# EAGLE schematic Schematic (EAGLE 8.6.0)
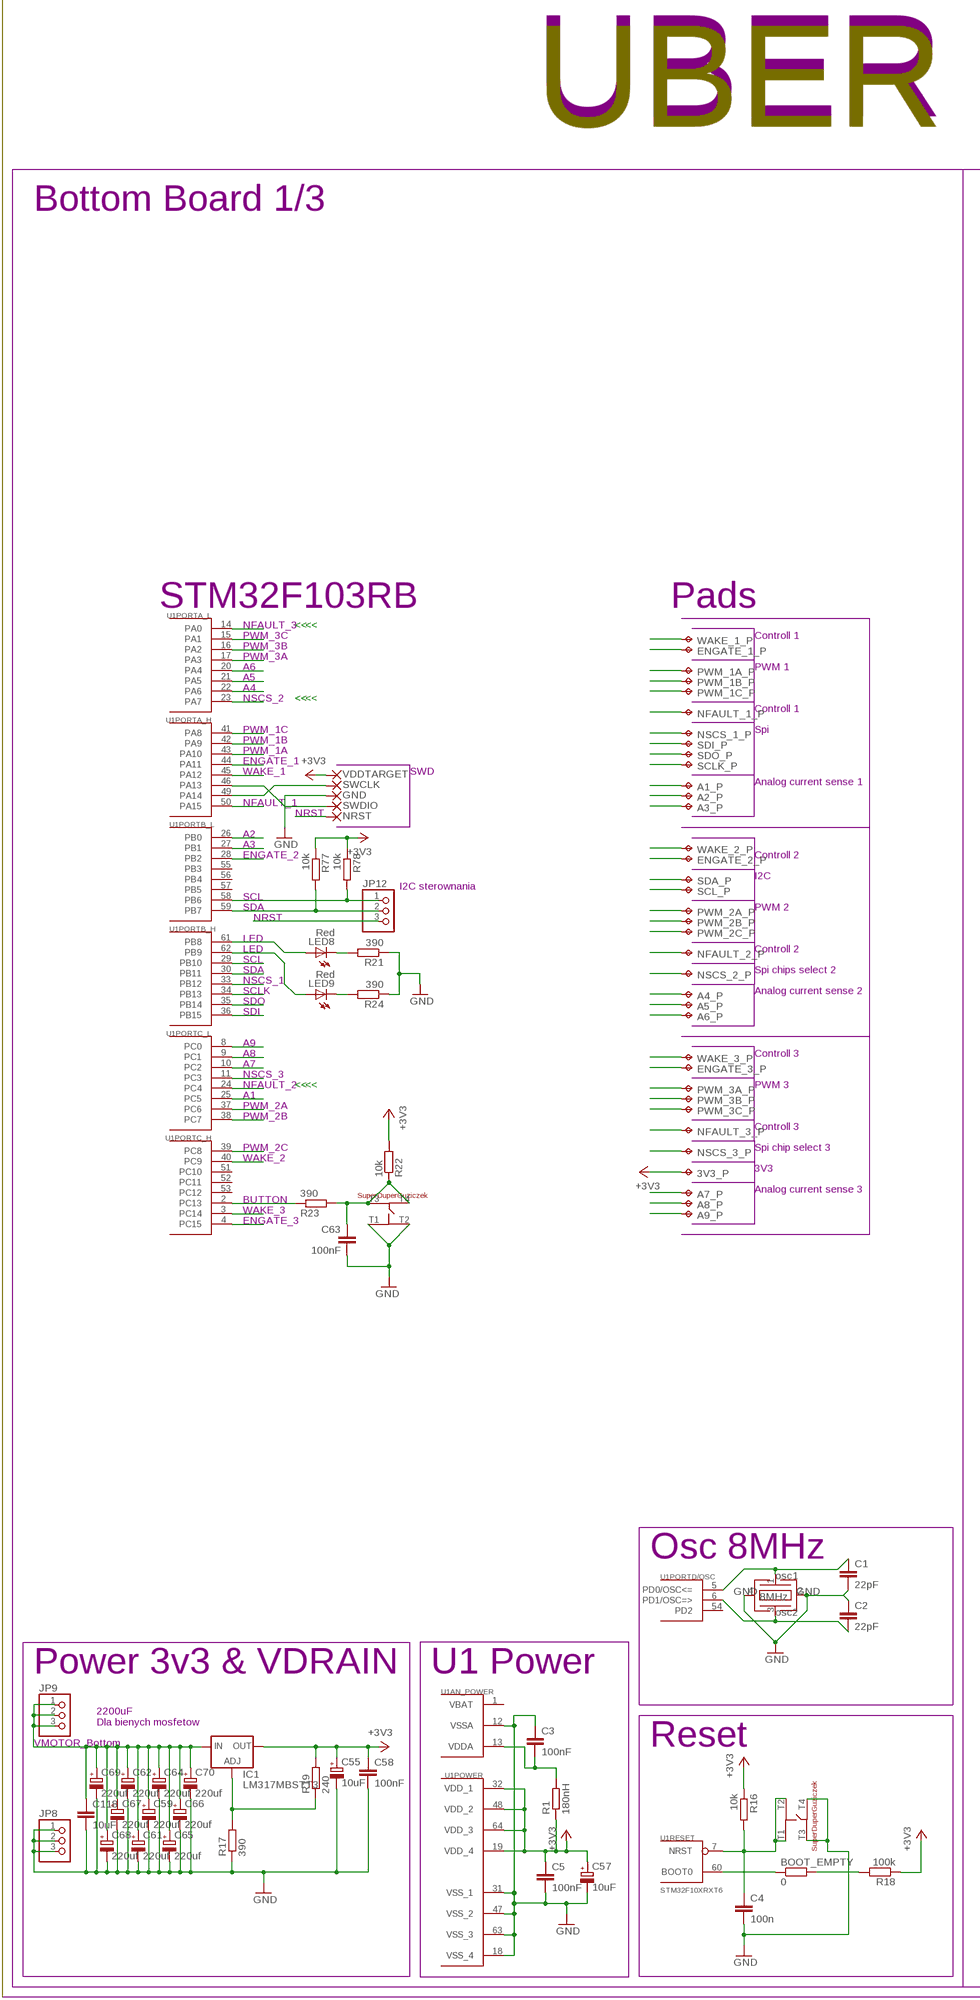
[diagram p0: schematic, sheet 1, part 1 of 3]
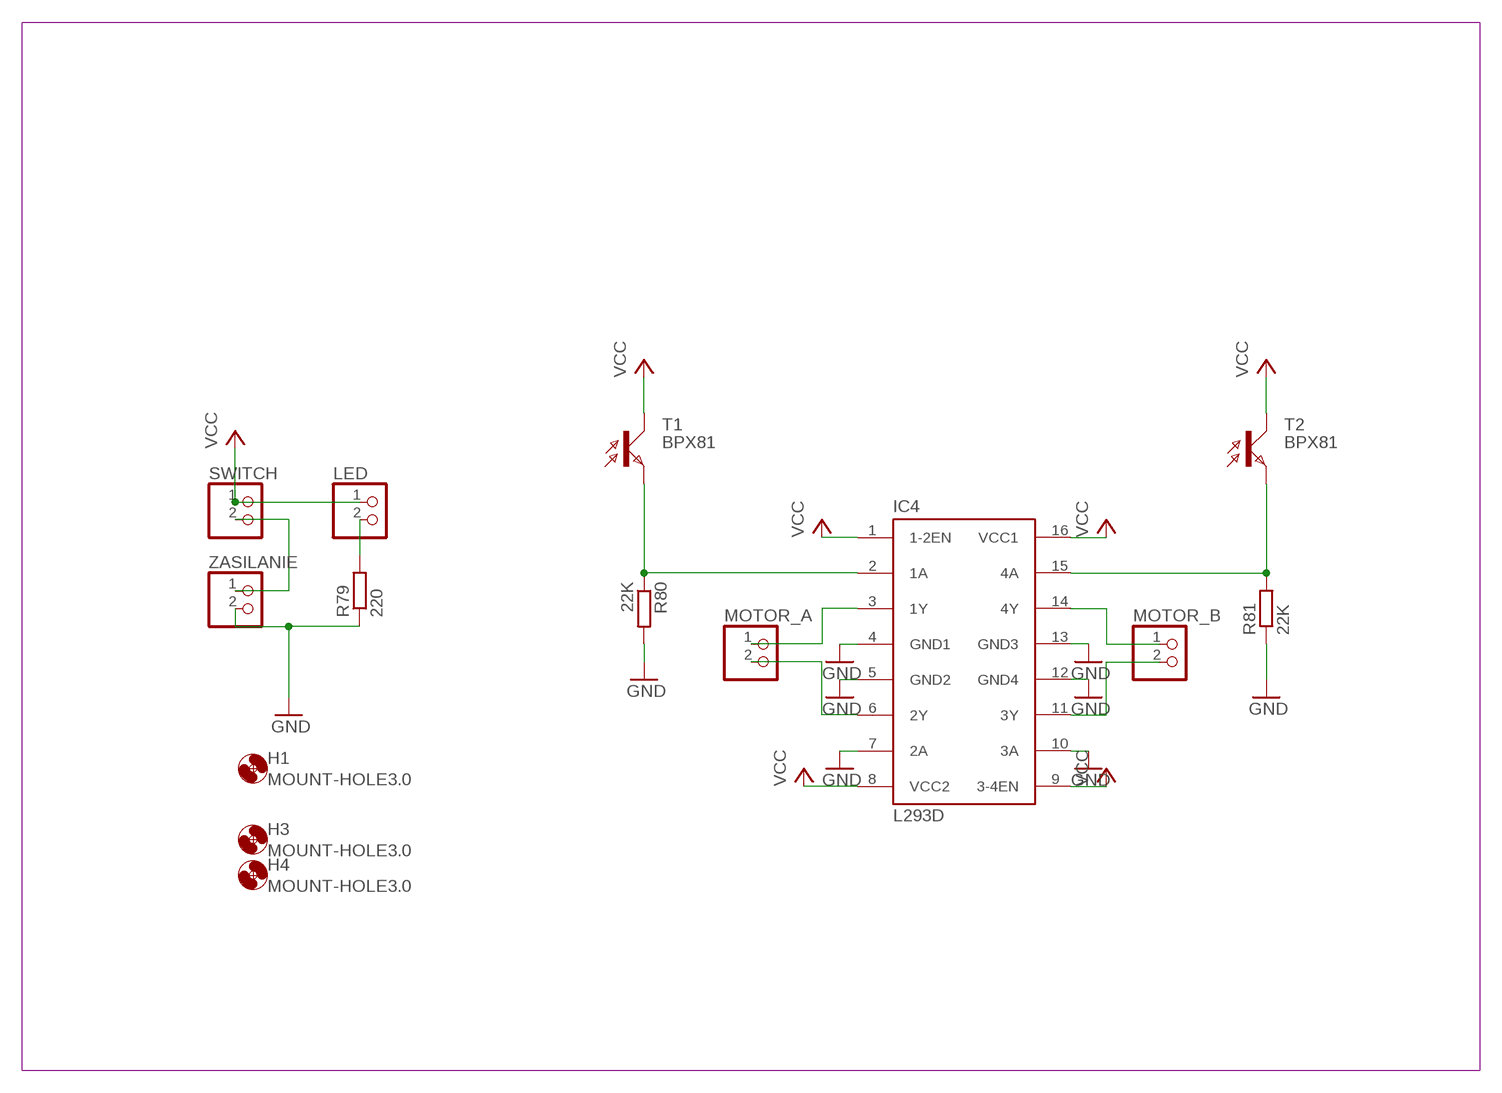
[diagram p1: schematic, sheet 1, part 2 of 3]
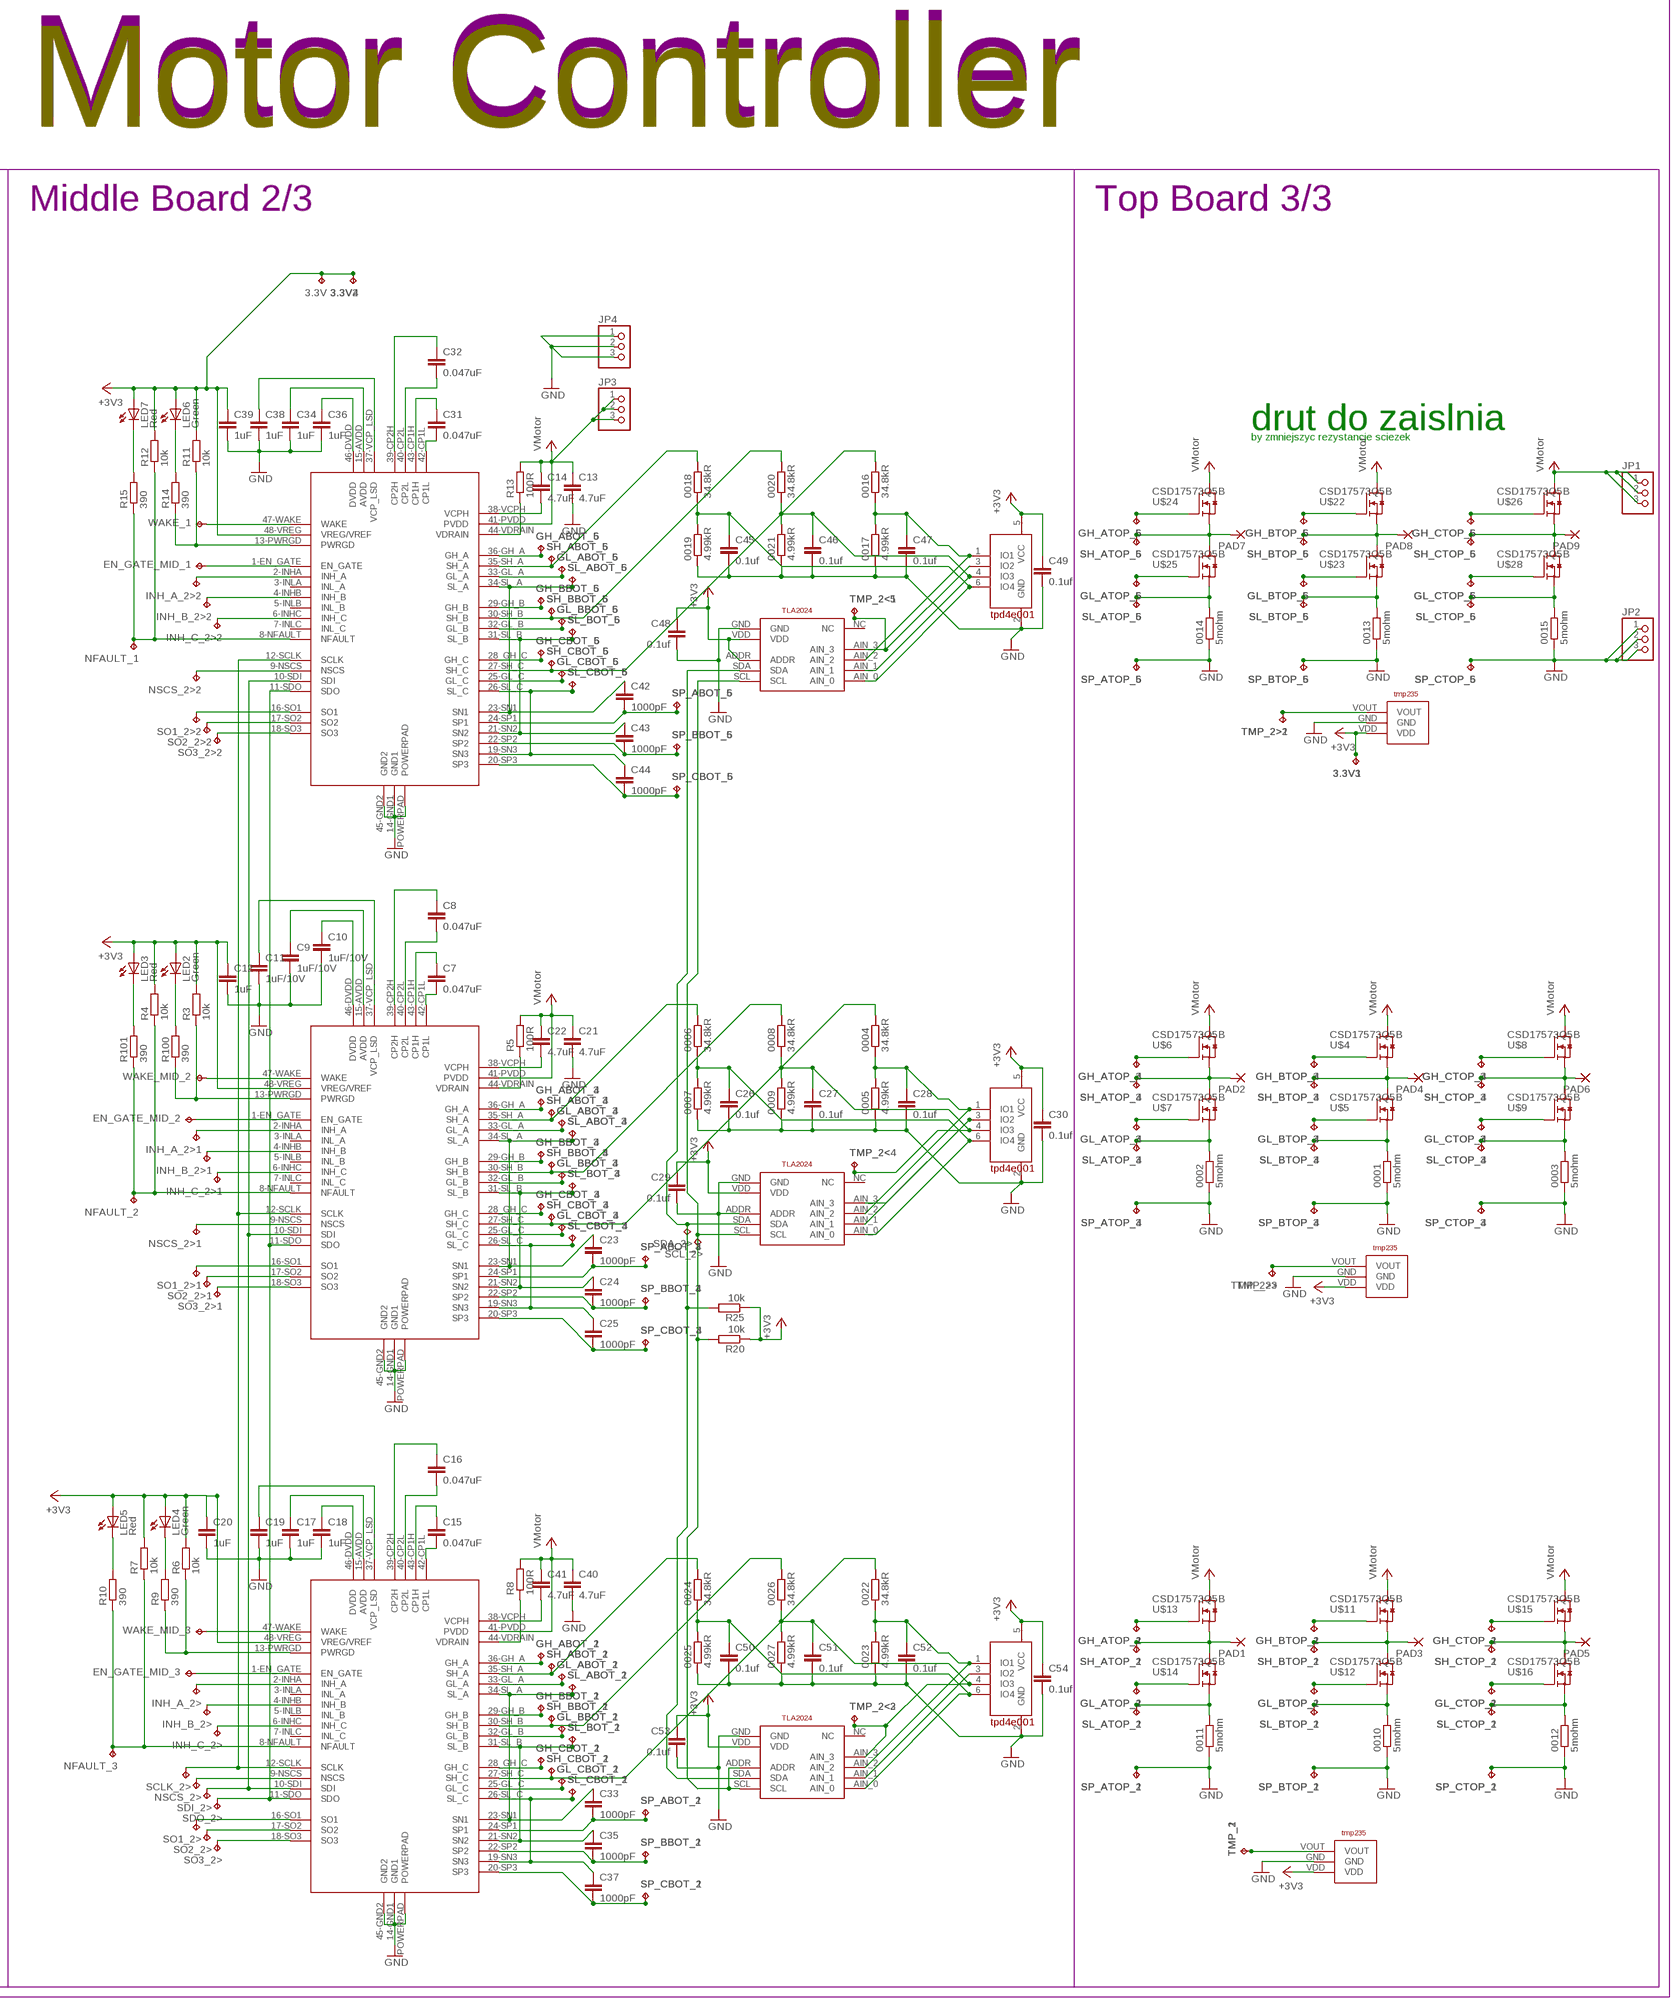
[diagram p2: schematic, sheet 1, part 3 of 3]

## Parts
0001  5mohm  R-EU_R2512  [R2512]
0002  5mohm  R-EU_R2512  [R2512]
0003  5mohm  R-EU_R2512  [R2512]
3.3V  TPTP09SQ  [TP09SQ]
3.3V1  TPTP09SQ  [TP09SQ]
3.3V2  TPTP09SQ  [TP09SQ]
3.3V3  TPTP09SQ  [TP09SQ]
3.3V4  TPTP09SQ  [TP09SQ]
3V3_P  TPTP09SQ  [TP09SQ]
0004  34.8kR  R-EU_R0603  [R0603]
0005  4.99kR  R-EU_R0603  [R0603]
0006  34.8kR  R-EU_R0603  [R0603]
0007  4.99kR  R-EU_R0603  [R0603]
0008  34.8kR  R-EU_R0603  [R0603]
0009  4.99kR  R-EU_R0603  [R0603]
0010  5mohm  R-EU_R2512  [R2512]
0011  5mohm  R-EU_R2512  [R2512]
0012  5mohm  R-EU_R2512  [R2512]
0013  5mohm  R-EU_R2512  [R2512]
0014  5mohm  R-EU_R2512  [R2512]
0015  5mohm  R-EU_R2512  [R2512]
0016  34.8kR  R-EU_R0603  [R0603]
0017  4.99kR  R-EU_R0603  [R0603]
0018  34.8kR  R-EU_R0603  [R0603]
0019  4.99kR  R-EU_R0603  [R0603]
0020  34.8kR  R-EU_R0603  [R0603]
0021  4.99kR  R-EU_R0603  [R0603]
0022  34.8kR  R-EU_R0603  [R0603]
0023  4.99kR  R-EU_R0603  [R0603]
0024  34.8kR  R-EU_R0603  [R0603]
0025  4.99kR  R-EU_R0603  [R0603]
0026  34.8kR  R-EU_R0603  [R0603]
0027  4.99kR  R-EU_R0603  [R0603]
A1_P  TPTP09SQ  [TP09SQ]
A2_P  TPTP09SQ  [TP09SQ]
A3_P  TPTP09SQ  [TP09SQ]
A4_P  TPTP09SQ  [TP09SQ]
A5_P  TPTP09SQ  [TP09SQ]
A6_P  TPTP09SQ  [TP09SQ]
A7_P  TPTP09SQ  [TP09SQ]
A8_P  TPTP09SQ  [TP09SQ]
A9_P  TPTP09SQ  [TP09SQ]
BOOT_EMPTY  0  R-EU_R0603  [R0603]
C1  22pF  C-EUC0603  [C0603]
C2  22pF  C-EUC0603  [C0603]
C3  100nF  C-EUC0603  [C0603]
C4  100n  C-EUC0603  [C0603]
C5  100nF  C-EUC0603  [C0603]
C7  0.047uF  C-EUC0603  [C0603]
C8  0.047uF  C-EUC0603  [C0603]
C9  1uF/10V  C-EUC0603  [C0603]
C10  1uF/10V  C-EUC0603  [C0603]
C11  1uF/10V  C-EUC0603  [C0603]
C12  1uF  C-EUC0603  [C0603]
C13  4.7uF  C-EUC0805  [C0805]
C14  4.7uF  C-EUC0805  [C0805]
C15  0.047uF  C-EUC0603  [C0603]
C16  0.047uF  C-EUC0603  [C0603]
C17  1uF  C-EUC0603  [C0603]
C18  1uF  C-EUC0603  [C0603]
C19  1uF  C-EUC0603  [C0603]
C20  1uF  C-EUC0603  [C0603]
C21  4.7uF  C-EUC0805  [C0805]
C22  4.7uF  C-EUC0805  [C0805]
C23  1000pF  C-EUC0603  [C0603]
C24  1000pF  C-EUC0603  [C0603]
C25  1000pF  C-EUC0603  [C0603]
C26  0.1uf  C-EUC0603  [C0603]
C27  0.1uf  C-EUC0603  [C0603]
C28  0.1uf  C-EUC0603  [C0603]
C29  0.1uf  C-EUC0603  [C0603]
C30  0.1uf  C-EUC0603  [C0603]
C31  0.047uF  C-EUC0603  [C0603]
C32  0.047uF  C-EUC0603  [C0603]
C33  1000pF  C-EUC0603  [C0603]
C34  1uF  C-EUC0603  [C0603]
C35  1000pF  C-EUC0603  [C0603]
C36  1uF  C-EUC0603  [C0603]
C37  1000pF  C-EUC0603  [C0603]
C38  1uF  C-EUC0603  [C0603]
C39  1uF  C-EUC0603  [C0603]
C40  4.7uF  C-EUC0805  [C0805]
C41  4.7uF  C-EUC0805  [C0805]
C42  1000pF  C-EUC0603  [C0603]
C43  1000pF  C-EUC0603  [C0603]
C44  1000pF  C-EUC0603  [C0603]
C45  0.1uf  C-EUC0603  [C0603]
C46  0.1uf  C-EUC0603  [C0603]
C47  0.1uf  C-EUC0603  [C0603]
C48  0.1uf  C-EUC0603  [C0603]
C49  0.1uf  C-EUC0603  [C0603]
C50  0.1uf  C-EUC0603  [C0603]
C51  0.1uf  C-EUC0603  [C0603]
C52  0.1uf  C-EUC0603  [C0603]
C53  0.1uf  C-EUC0603  [C0603]
C54  0.1uf  C-EUC0603  [C0603]
C55  10uF  CPOL-EUSMCA  [SMC_A]
C57  10uF  CPOL-EUSMCA  [SMC_A]
C58  100nF  C-EUC0603  [C0603]
C59  220uf  CPOL-EU150CLZ-0810  [150CLZ-0810]
C61  220uf  CPOL-EU150CLZ-0810  [150CLZ-0810]
C62  220uf  CPOL-EU150CLZ-0810  [150CLZ-0810]
C63  100nF  C-EUC0603  [C0603]
C64  220uf  CPOL-EU150CLZ-0810  [150CLZ-0810]
C65  220uf  CPOL-EU150CLZ-0810  [150CLZ-0810]
C66  220uf  CPOL-EU150CLZ-0810  [150CLZ-0810]
C67  220uf  CPOL-EU150CLZ-0810  [150CLZ-0810]
C68  220uf  CPOL-EU150CLZ-0810  [150CLZ-0810]
C69  220uf  CPOL-EU150CLZ-0810  [150CLZ-0810]
C70  220uf  CPOL-EU150CLZ-0810  [150CLZ-0810]
C118  10uF  C-EUC1206  [C1206]
EN_GATE_MID_1  TPTP09SQ  [TP09SQ]
EN_GATE_MID_2  TPTP09SQ  [TP09SQ]
EN_GATE_MID_3  TPTP09SQ  [TP09SQ]
ENGATE_1_P  TPTP09SQ  [TP09SQ]
ENGATE_2_P  TPTP09SQ  [TP09SQ]
ENGATE_3_P  TPTP09SQ  [TP09SQ]
GH_ABOT_1  TPTP09SQ  [TP09SQ]
GH_ABOT_2  TPTP09SQ  [TP09SQ]
GH_ABOT_3  TPTP09SQ  [TP09SQ]
GH_ABOT_4  TPTP09SQ  [TP09SQ]
GH_ABOT_5  TPTP09SQ  [TP09SQ]
GH_ABOT_6  TPTP09SQ  [TP09SQ]
GH_ATOP_1  TPTP09SQ  [TP09SQ]
GH_ATOP_2  TPTP09SQ  [TP09SQ]
GH_ATOP_3  TPTP09SQ  [TP09SQ]
GH_ATOP_4  TPTP09SQ  [TP09SQ]
GH_ATOP_5  TPTP09SQ  [TP09SQ]
GH_ATOP_6  TPTP09SQ  [TP09SQ]
GH_BBOT_1  TPTP07SQ  [TP07SQ]
GH_BBOT_2  TPTP07SQ  [TP07SQ]
GH_BBOT_3  TPTP07SQ  [TP07SQ]
GH_BBOT_4  TPTP07SQ  [TP07SQ]
GH_BBOT_5  TPTP07SQ  [TP07SQ]
GH_BBOT_6  TPTP07SQ  [TP07SQ]
GH_BTOP_1  TPTP07SQ  [TP07SQ]
GH_BTOP_2  TPTP07SQ  [TP07SQ]
GH_BTOP_3  TPTP07SQ  [TP07SQ]
GH_BTOP_4  TPTP07SQ  [TP07SQ]
GH_BTOP_5  TPTP07SQ  [TP07SQ]
GH_BTOP_6  TPTP07SQ  [TP07SQ]
GH_CBOT_1  TPTP09SQ  [TP09SQ]
GH_CBOT_2  TPTP09SQ  [TP09SQ]
GH_CBOT_3  TPTP09SQ  [TP09SQ]
GH_CBOT_4  TPTP09SQ  [TP09SQ]
GH_CBOT_5  TPTP09SQ  [TP09SQ]
GH_CBOT_6  TPTP09SQ  [TP09SQ]
GH_CTOP_1  TPTP09SQ  [TP09SQ]
GH_CTOP_2  TPTP09SQ  [TP09SQ]
GH_CTOP_3  TPTP09SQ  [TP09SQ]
GH_CTOP_4  TPTP09SQ  [TP09SQ]
GH_CTOP_5  TPTP09SQ  [TP09SQ]
GH_CTOP_6  TPTP09SQ  [TP09SQ]
GL_ABOT_1  TPTP07SQ  [TP07SQ]
GL_ABOT_2  TPTP07SQ  [TP07SQ]
GL_ABOT_3  TPTP07SQ  [TP07SQ]
GL_ABOT_4  TPTP07SQ  [TP07SQ]
GL_ABOT_5  TPTP07SQ  [TP07SQ]
GL_ABOT_6  TPTP07SQ  [TP07SQ]
GL_ATOP_1  TPTP07SQ  [TP07SQ]
GL_ATOP_2  TPTP07SQ  [TP07SQ]
GL_ATOP_3  TPTP07SQ  [TP07SQ]
GL_ATOP_4  TPTP07SQ  [TP07SQ]
GL_ATOP_5  TPTP07SQ  [TP07SQ]
GL_ATOP_6  TPTP07SQ  [TP07SQ]
GL_BBOT_1  TPTP09SQ  [TP09SQ]
GL_BBOT_2  TPTP09SQ  [TP09SQ]
GL_BBOT_3  TPTP09SQ  [TP09SQ]
GL_BBOT_4  TPTP09SQ  [TP09SQ]
GL_BBOT_5  TPTP09SQ  [TP09SQ]
GL_BBOT_6  TPTP09SQ  [TP09SQ]
GL_BTOP_1  TPTP09SQ  [TP09SQ]
GL_BTOP_2  TPTP09SQ  [TP09SQ]
GL_BTOP_3  TPTP09SQ  [TP09SQ]
GL_BTOP_4  TPTP09SQ  [TP09SQ]
GL_BTOP_5  TPTP09SQ  [TP09SQ]
GL_BTOP_6  TPTP09SQ  [TP09SQ]
GL_CBOT_1  TPTP07SQ  [TP07SQ]
GL_CBOT_2  TPTP07SQ  [TP07SQ]
GL_CBOT_3  TPTP07SQ  [TP07SQ]
GL_CBOT_4  TPTP07SQ  [TP07SQ]
GL_CBOT_5  TPTP07SQ  [TP07SQ]
GL_CBOT_6  TPTP07SQ  [TP07SQ]
GL_CTOP_1  TPTP07SQ  [TP07SQ]
GL_CTOP_2  TPTP07SQ  [TP07SQ]
GL_CTOP_3  TPTP07SQ  [TP07SQ]
GL_CTOP_4  TPTP07SQ  [TP07SQ]
GL_CTOP_5  TPTP07SQ  [TP07SQ]
GL_CTOP_6  TPTP07SQ  [TP07SQ]
GND  WIREPADSMD1,27-254  [SMD1,27-2,54]
H1  MOUNT-HOLE3.0  [3,0]
H3  MOUNT-HOLE3.0  [3,0]
H4  MOUNT-HOLE3.0  [3,0]
IC1  LM317MBSTT3  [SOT223]
IC4  L293D  [DIL16]
INH_A_2>  TPTP09SQ  [TP09SQ]
INH_A_2>1  TPTP09SQ  [TP09SQ]
INH_A_2>2  TPTP09SQ  [TP09SQ]
INH_B_2>  TPTP09SQ  [TP09SQ]
INH_B_2>1  TPTP09SQ  [TP09SQ]
INH_B_2>2  TPTP09SQ  [TP09SQ]
INH_C_2>  TPTP09SQ  [TP09SQ]
INH_C_2>1  TPTP09SQ  [TP09SQ]
INH_C_2>2  TPTP09SQ  [TP09SQ]
JP1  PINHD-1X3  [1X03]
JP2  PINHD-1X3  [1X03]
JP3  PINHD-1X3  [1X03]
JP4  PINHD-1X3  [1X03]
JP8  PINHD-1X3  [1X03]
JP9  PINHD-1X3  [1X03]
JP12  PINHD-1X3  [1X03]
LED  PINHD-1X2  [1X02]
LED2  Green  LEDSML0603  [SML0603]
LED3  Red  LEDSML0603  [SML0603]
LED4  Green  LEDSML0603  [SML0603]
LED5  Red  LEDSML0603  [SML0603]
LED6  Green  LEDSML0603  [SML0603]
LED7  Red  LEDSML0603  [SML0603]
LED8  Red  LEDSML0603  [SML0603]
LED9  Red  LEDSML0603  [SML0603]
MOTOR_A  PINHD-1X2  [1X02]
MOTOR_B  PINHD-1X2  [1X02]
NFAULT_1  TPTP09SQ  [TP09SQ]
NFAULT_1_P  TPTP09SQ  [TP09SQ]
NFAULT_2  TPTP09SQ  [TP09SQ]
NFAULT_2_P  TPTP09SQ  [TP09SQ]
NFAULT_3  TPTP09SQ  [TP09SQ]
NFAULT_3_P  TPTP09SQ  [TP09SQ]
NRST  WIREPADSMD1,27-254  [SMD1,27-2,54]
NSCS_1_P  TPTP09SQ  [TP09SQ]
NSCS_2>  TPTP09SQ  [TP09SQ]
NSCS_2>1  TPTP09SQ  [TP09SQ]
NSCS_2>2  TPTP09SQ  [TP09SQ]
NSCS_2_P  TPTP09SQ  [TP09SQ]
NSCS_3_P  TPTP09SQ  [TP09SQ]
PAD1  SMD5  [SMD2,54-5,08]
PAD2  SMD5  [SMD2,54-5,08]
PAD3  SMD5  [SMD2,54-5,08]
PAD4  SMD5  [SMD2,54-5,08]
PAD5  SMD5  [SMD2,54-5,08]
PAD6  SMD5  [SMD2,54-5,08]
PAD7  SMD5  [SMD2,54-5,08]
PAD8  SMD5  [SMD2,54-5,08]
PAD9  SMD5  [SMD2,54-5,08]
PWM_1A_P  TPTP09SQ  [TP09SQ]
PWM_1B_P  TPTP09SQ  [TP09SQ]
PWM_1C_P  TPTP09SQ  [TP09SQ]
PWM_2A_P  TPTP09SQ  [TP09SQ]
PWM_2B_P  TPTP09SQ  [TP09SQ]
PWM_2C_P  TPTP09SQ  [TP09SQ]
PWM_3A_P  TPTP09SQ  [TP09SQ]
PWM_3B_P  TPTP09SQ  [TP09SQ]
PWM_3C_P  TPTP09SQ  [TP09SQ]
R1  180nH  R-EU_R0603  [R0603]
R3  10k  R-EU_R0603  [R0603]
R4  10k  R-EU_R0603  [R0603]
R5  100R  R-EU_R0603  [R0603]
R6  10k  R-EU_R0603  [R0603]
R7  10k  R-EU_R0603  [R0603]
R8  100R  R-EU_R0603  [R0603]
R9  390  R-EU_R0603  [R0603]
R10  390  R-EU_R0603  [R0603]
R11  10k  R-EU_R0603  [R0603]
R12  10k  R-EU_R0603  [R0603]
R13  100R  R-EU_R0603  [R0603]
R14  390  R-EU_R0603  [R0603]
R15  390  R-EU_R0603  [R0603]
R16  10k  R-EU_R0603  [R0603]
R17  390  R-EU_R0603  [R0603]
R18  100k  R-EU_R0603  [R0603]
R19  240  R-EU_R0603  [R0603]
R20  10k  R-EU_R0603  [R0603]
R21  390  R-EU_R0603  [R0603]
R22  10k  R-EU_R0603  [R0603]
R23  390  R-EU_R0603  [R0603]
R24  390  R-EU_R0603  [R0603]
R25  10k  R-EU_R0603  [R0603]
R77  10k  R-EU_R0603  [R0603]
R78  10k  R-EU_R0603  [R0603]
R79  220  R-EU_R0805  [R0805]
R80  22K  R-EU_R0805  [R0805]
R81  22K  R-EU_R0805  [R0805]
R100  390  R-EU_R0603  [R0603]
R101  390  R-EU_R0603  [R0603]
SCL_2>  TPTP09SQ  [TP09SQ]
SCL_P  TPTP09SQ  [TP09SQ]
SCLK_2>  TPTP09SQ  [TP09SQ]
SCLK_P  TPTP09SQ  [TP09SQ]
SDA_2>  TPTP09SQ  [TP09SQ]
SDA_P  TPTP09SQ  [TP09SQ]
SDI_2>  TPTP09SQ  [TP09SQ]
SDI_P  TPTP09SQ  [TP09SQ]
SDO_2>  TPTP09SQ  [TP09SQ]
SDO_P  TPTP09SQ  [TP09SQ]
SH_ABOT_1  TPTP09SQ  [TP09SQ]
SH_ABOT_2  TPTP09SQ  [TP09SQ]
SH_ABOT_3  TPTP09SQ  [TP09SQ]
SH_ABOT_4  TPTP09SQ  [TP09SQ]
SH_ABOT_5  TPTP09SQ  [TP09SQ]
SH_ABOT_6  TPTP09SQ  [TP09SQ]
SH_ATOP_1  TPTP09SQ  [TP09SQ]
SH_ATOP_2  TPTP09SQ  [TP09SQ]
SH_ATOP_3  TPTP09SQ  [TP09SQ]
SH_ATOP_4  TPTP09SQ  [TP09SQ]
SH_ATOP_5  TPTP09SQ  [TP09SQ]
SH_ATOP_6  TPTP09SQ  [TP09SQ]
SH_BBOT_1  TPTP09SQ  [TP09SQ]
SH_BBOT_2  TPTP09SQ  [TP09SQ]
SH_BBOT_3  TPTP09SQ  [TP09SQ]
SH_BBOT_4  TPTP09SQ  [TP09SQ]
SH_BBOT_5  TPTP09SQ  [TP09SQ]
SH_BBOT_6  TPTP09SQ  [TP09SQ]
SH_BTOP_1  TPTP09SQ  [TP09SQ]
SH_BTOP_2  TPTP09SQ  [TP09SQ]
SH_BTOP_3  TPTP09SQ  [TP09SQ]
SH_BTOP_4  TPTP09SQ  [TP09SQ]
SH_BTOP_5  TPTP09SQ  [TP09SQ]
SH_BTOP_6  TPTP09SQ  [TP09SQ]
SH_CBOT_1  TPTP09SQ  [TP09SQ]
SH_CBOT_2  TPTP09SQ  [TP09SQ]
SH_CBOT_3  TPTP09SQ  [TP09SQ]
SH_CBOT_4  TPTP09SQ  [TP09SQ]
SH_CBOT_5  TPTP09SQ  [TP09SQ]
SH_CBOT_6  TPTP09SQ  [TP09SQ]
SH_CTOP_1  TPTP09SQ  [TP09SQ]
SH_CTOP_2  TPTP09SQ  [TP09SQ]
SH_CTOP_3  TPTP09SQ  [TP09SQ]
SH_CTOP_4  TPTP09SQ  [TP09SQ]
SH_CTOP_5  TPTP09SQ  [TP09SQ]
SH_CTOP_6  TPTP09SQ  [TP09SQ]
SL_ABOT_1  TPTP09SQ  [TP09SQ]
SL_ABOT_2  TPTP09SQ  [TP09SQ]
SL_ABOT_3  TPTP09SQ  [TP09SQ]
SL_ABOT_4  TPTP09SQ  [TP09SQ]
SL_ABOT_5  TPTP09SQ  [TP09SQ]
SL_ABOT_6  TPTP09SQ  [TP09SQ]
SL_ATOP_1  TPTP09SQ  [TP09SQ]
SL_ATOP_2  TPTP09SQ  [TP09SQ]
SL_ATOP_3  TPTP09SQ  [TP09SQ]
SL_ATOP_4  TPTP09SQ  [TP09SQ]
SL_ATOP_5  TPTP09SQ  [TP09SQ]
SL_ATOP_6  TPTP09SQ  [TP09SQ]
SL_BOT_1  TPTP09SQ  [TP09SQ]
SL_BOT_2  TPTP09SQ  [TP09SQ]
SL_BOT_3  TPTP09SQ  [TP09SQ]
SL_BOT_4  TPTP09SQ  [TP09SQ]
SL_BOT_5  TPTP09SQ  [TP09SQ]
SL_BOT_6  TPTP09SQ  [TP09SQ]
SL_BTOP_1  TPTP09SQ  [TP09SQ]
SL_BTOP_2  TPTP09SQ  [TP09SQ]
SL_BTOP_3  TPTP09SQ  [TP09SQ]
SL_BTOP_4  TPTP09SQ  [TP09SQ]
SL_BTOP_5  TPTP09SQ  [TP09SQ]
SL_BTOP_6  TPTP09SQ  [TP09SQ]
SL_CBOT_1  TPTP09SQ  [TP09SQ]
SL_CBOT_2  TPTP09SQ  [TP09SQ]
SL_CBOT_3  TPTP09SQ  [TP09SQ]
SL_CBOT_4  TPTP09SQ  [TP09SQ]
SL_CBOT_5  TPTP09SQ  [TP09SQ]
SL_CBOT_6  TPTP09SQ  [TP09SQ]
SL_CTOP_1  TPTP09SQ  [TP09SQ]
SL_CTOP_2  TPTP09SQ  [TP09SQ]
SL_CTOP_3  TPTP09SQ  [TP09SQ]
SL_CTOP_4  TPTP09SQ  [TP09SQ]
SL_CTOP_5  TPTP09SQ  [TP09SQ]
SL_CTOP_6  TPTP09SQ  [TP09SQ]
SO1_2>  TPTP09SQ  [TP09SQ]
SO1_2>1  TPTP09SQ  [TP09SQ]
SO1_2>2  TPTP09SQ  [TP09SQ]
SO2_2>  TPTP09SQ  [TP09SQ]
SO2_2>1  TPTP09SQ  [TP09SQ]
SO2_2>2  TPTP09SQ  [TP09SQ]
SO3_2>  TPTP09SQ  [TP09SQ]
SO3_2>1  TPTP09SQ  [TP09SQ]
SO3_2>2  TPTP09SQ  [TP09SQ]
SP_ABOT_1  TPTP09SQ  [TP09SQ]
SP_ABOT_2  TPTP09SQ  [TP09SQ]
SP_ABOT_3  TPTP09SQ  [TP09SQ]
SP_ABOT_4  TPTP09SQ  [TP09SQ]
SP_ABOT_5  TPTP09SQ  [TP09SQ]
SP_ABOT_6  TPTP09SQ  [TP09SQ]
SP_ATOP_1  TPTP09SQ  [TP09SQ]
SP_ATOP_2  TPTP09SQ  [TP09SQ]
SP_ATOP_3  TPTP09SQ  [TP09SQ]
SP_ATOP_4  TPTP09SQ  [TP09SQ]
SP_ATOP_5  TPTP09SQ  [TP09SQ]
SP_ATOP_6  TPTP09SQ  [TP09SQ]
SP_BBOT_1  TPTP09SQ  [TP09SQ]
SP_BBOT_2  TPTP09SQ  [TP09SQ]
SP_BBOT_3  TPTP09SQ  [TP09SQ]
SP_BBOT_4  TPTP09SQ  [TP09SQ]
SP_BBOT_5  TPTP09SQ  [TP09SQ]
SP_BBOT_6  TPTP09SQ  [TP09SQ]
SP_BTOP_1  TPTP09SQ  [TP09SQ]
SP_BTOP_2  TPTP09SQ  [TP09SQ]
SP_BTOP_3  TPTP09SQ  [TP09SQ]
SP_BTOP_4  TPTP09SQ  [TP09SQ]
SP_BTOP_5  TPTP09SQ  [TP09SQ]
SP_BTOP_6  TPTP09SQ  [TP09SQ]
SP_CBOT_1  TPTP09SQ  [TP09SQ]
SP_CBOT_2  TPTP09SQ  [TP09SQ]
SP_CBOT_3  TPTP09SQ  [TP09SQ]
SP_CBOT_4  TPTP09SQ  [TP09SQ]
SP_CBOT_5  TPTP09SQ  [TP09SQ]
SP_CBOT_6  TPTP09SQ  [TP09SQ]
SP_CTOP_1  TPTP09SQ  [TP09SQ]
SP_CTOP_2  TPTP09SQ  [TP09SQ]
SP_CTOP_3  TPTP09SQ  [TP09SQ]
SP_CTOP_4  TPTP09SQ  [TP09SQ]
SP_CTOP_5  TPTP09SQ  [TP09SQ]
SP_CTOP_6  TPTP09SQ  [TP09SQ]
SWCLK  WIREPADSMD1,27-254  [SMD1,27-2,54]
SWDIO  WIREPADSMD1,27-254  [SMD1,27-2,54]
SWITCH  PINHD-1X2  [1X02]
T1  BPX81  [BPX81]
T2  BPX81  [BPX81]
TMP_1  TPTP09SQ  [TP09SQ]
TMP_2  TPTP09SQ  [TP09SQ]
TMP_2<  TPTP09SQ  [TP09SQ]
TMP_2<1  TPTP09SQ  [TP09SQ]
TMP_2<2  TPTP09SQ  [TP09SQ]
TMP_2<3  TPTP09SQ  [TP09SQ]
TMP_2<4  TPTP09SQ  [TP09SQ]
TMP_2<5  TPTP09SQ  [TP09SQ]
TMP_2>  TPTP09SQ  [TP09SQ]
TMP_2>1  TPTP09SQ  [TP09SQ]
TMP_2>2  TPTP09SQ  [TP09SQ]
TMP_2>3  TPTP09SQ  [TP09SQ]
U1  STM32F10XRXT6  [TQFP64]
U$2  SUPER_DUPER_GUZICZEK  [SUPER_DUPER_GUZICZEK]
U$3  DRV8305  [S-PQFP-G48]
U$4  CSD17573Q5B  [Q5B]
U$5  CSD17573Q5B  [Q5B]
U$6  CSD17573Q5B  [Q5B]
U$7  CSD17573Q5B  [Q5B]
U$8  CSD17573Q5B  [Q5B]
U$9  CSD17573Q5B  [Q5B]
U$10  DRV8305  [S-PQFP-G48]
U$11  CSD17573Q5B  [Q5B]
U$12  CSD17573Q5B  [Q5B]
U$13  CSD17573Q5B  [Q5B]
U$14  CSD17573Q5B  [Q5B]
U$15  CSD17573Q5B  [Q5B]
U$16  CSD17573Q5B  [Q5B]
U$17  TLA2024  [X2QFN]
U$18  TMP235  [SOT-23]
U$19  TMP235  [SOT-23]
U$20  TPD4E001  [SOT-23]
U$21  DRV8305  [S-PQFP-G48]
U$22  CSD17573Q5B  [Q5B]
U$23  CSD17573Q5B  [Q5B]
U$24  CSD17573Q5B  [Q5B]
U$25  CSD17573Q5B  [Q5B]
U$26  CSD17573Q5B  [Q5B]
U$27  SUPER_DUPER_GUZICZEK  [SUPER_DUPER_GUZICZEK]
U$28  CSD17573Q5B  [Q5B]
U$29  TLA2024  [X2QFN]
U$30  TMP235  [SOT-23]
U$31  TPD4E001  [SOT-23]
U$32  TLA2024  [X2QFN]
U$33  TPD4E001  [SOT-23]
U$35  8MHZ  [SMD]
VDDTARGET  WIREPADSMD1,27-254  [SMD1,27-2,54]
WAKE_1  TPTP09SQ  [TP09SQ]
WAKE_1_P  TPTP09SQ  [TP09SQ]
WAKE_2_P  TPTP09SQ  [TP09SQ]
WAKE_3_P  TPTP09SQ  [TP09SQ]
WAKE_MID_2  TPTP09SQ  [TP09SQ]
WAKE_MID_3  TPTP09SQ  [TP09SQ]
ZASILANIE  PINHD-1X2  [1X02]

## Nets
+3V3: 3.3V1.TP 3.3V2.TP 3.3V3.TP 3.3V4.TP 3.3V.TP 3V3_P.TP C5.1 C12.1 C20.1 C29.1 C30.1 C39.1 C48.1 C49.1 C53.1 C54.1 C55.+ C57.+ C58.1 IC1.4(OUT) LED2.A LED3.A LED4.A LED5.A LED6.A LED7.A R1.1 R3.2 R4.2 R6.2 R7.2 R11.2 R12.2 R16.1 R18.1 R19.2 R20.1 R22.2 R25.1 R77.1 R78.1 U1.19(POWER:VDD_4) U1.32(POWER:VDD_1) U1.48(POWER:VDD_2) U1.64(POWER:VDD_3) U$3.48-VREG(VREG/VREF) U$10.48-VREG(VREG/VREF) U$17.VDD U$18.VDD U$19.VDD U$20.5(VCC) U$21.48-VREG(VREG/VREF) U$29.ADDR U$29.VDD U$30.VDD U$31.5(VCC) U$32.VDD U$33.5(VCC) VDDTARGET.1(P)
A1: A1_P.TP U1.25(PORTC_L:PC5)
A2: A2_P.TP U1.26(PORTB_L:PB0)
A3: A3_P.TP U1.27(PORTB_L:PB1)
A4: A4_P.TP U1.22(PORTA_L:PA6)
A5: A5_P.TP U1.21(PORTA_L:PA5)
A6: A6_P.TP U1.20(PORTA_L:PA4)
A7: A7_P.TP U1.10(PORTC_L:PC2)
A8: A8_P.TP U1.9(PORTC_L:PC1)
A9: A9_P.TP U1.8(PORTC_L:PC0)
AIN1: 0006.1 0007.2 C26.1 U$17.AIN_0 U$20.6(IO4)
AIN3: 0004.1 0005.2 C28.1 U$17.AIN_2 U$20.1(IO1)
AIN5: 0016.1 0017.2 C47.1 U$29.AIN_2 U$31.1(IO1)
AIN6: 0018.1 0019.2 C45.1 U$29.AIN_0 U$31.6(IO4)
AIN7: 0020.1 0021.2 C46.1 U$29.AIN_1 U$31.4(IO3)
AIN9: 0022.1 0023.2 C52.1 U$32.AIN_2 U$33.1(IO1)
AIN10: 0024.1 0025.2 C50.1 U$32.AIN_0 U$33.6(IO4)
AIN11: 0026.1 0027.2 C51.1 U$32.AIN_1 U$33.4(IO3)
EN_GATE_MID_1: EN_GATE_MID_1.TP U$21.1-EN_GATE(EN_GATE)
EN_GATE_MID_2: EN_GATE_MID_2.TP U$3.1-EN_GATE(EN_GATE)
EN_GATE_MID_3: EN_GATE_MID_3.TP U$10.1-EN_GATE(EN_GATE)
ENGATE_1: ENGATE_1_P.TP U1.44(PORTA_H:PA11)
ENGATE_2: ENGATE_2_P.TP U1.28(PORTB_L:PB2)
ENGATE_3: ENGATE_3_P.TP U1.4(PORTC_H:PC15)
GH_ABOT_1: GH_ABOT_1.TP GH_ABOT_2.TP U$10.36-GH_A(GH_A)
GH_ABOT_2: GH_ABOT_3.TP GH_ABOT_4.TP U$3.36-GH_A(GH_A)
GH_ABOT_3: GH_ABOT_5.TP GH_ABOT_6.TP U$21.36-GH_A(GH_A)
GH_ATOP_1: GH_ATOP_1.TP GH_ATOP_2.TP U$13.G
GH_ATOP_2: GH_ATOP_5.TP GH_ATOP_6.TP U$24.G
GH_ATOP_4: GH_ATOP_3.TP GH_ATOP_4.TP U$6.G
GH_BBOT_1: GH_BBOT_1.TP GH_BBOT_2.TP U$10.29-GH_B(GH_B)
GH_BBOT_2: GH_BBOT_3.TP GH_BBOT_4.TP U$3.29-GH_B(GH_B)
GH_BBOT_3: GH_BBOT_5.TP GH_BBOT_6.TP U$21.29-GH_B(GH_B)
GH_BTOP_1: GH_BTOP_1.TP GH_BTOP_2.TP U$11.G
GH_BTOP_2: GH_BTOP_5.TP GH_BTOP_6.TP U$22.G
GH_BTOP_4: GH_BTOP_3.TP GH_BTOP_4.TP U$4.G
GH_C_2>: GH_CTOP_1.TP GH_CTOP_2.TP U$15.G
GH_CBOT_1: GH_CBOT_1.TP GH_CBOT_2.TP U$10.28_GH_C(GH_C)
GH_CBOT_2: GH_CBOT_3.TP GH_CBOT_4.TP U$3.28_GH_C(GH_C)
GH_CBOT_3: GH_CBOT_5.TP GH_CBOT_6.TP U$21.28_GH_C(GH_C)
GH_CTOP_1: GH_CTOP_5.TP GH_CTOP_6.TP U$26.G
GH_CTOP_4: GH_CTOP_3.TP GH_CTOP_4.TP U$8.G
GL_ABOT_1: GL_ABOT_1.TP GL_ABOT_2.TP U$10.33-GL_A(GL_A)
GL_ABOT_2: GL_ABOT_3.TP GL_ABOT_4.TP U$3.33-GL_A(GL_A)
GL_ABOT_3: GL_ABOT_5.TP GL_ABOT_6.TP U$21.33-GL_A(GL_A)
GL_ATOP_1: GL_ATOP_1.TP GL_ATOP_2.TP U$14.G
GL_ATOP_2: GL_ATOP_5.TP GL_ATOP_6.TP U$25.G
GL_ATOP_4: GL_ATOP_3.TP GL_ATOP_4.TP U$7.G
GL_BBOT_1: GL_BBOT_1.TP GL_BBOT_2.TP U$10.32-GL_B(GL_B)
GL_BBOT_2: GL_BBOT_3.TP GL_BBOT_4.TP U$3.32-GL_B(GL_B)
GL_BBOT_3: GL_BBOT_5.TP GL_BBOT_6.TP U$21.32-GL_B(GL_B)
GL_BTOP_1: GL_BTOP_1.TP GL_BTOP_2.TP U$12.G
GL_BTOP_2: GL_BTOP_5.TP GL_BTOP_6.TP U$23.G
GL_BTOP_4: GL_BTOP_3.TP GL_BTOP_4.TP U$5.G
GL_CBOT_1: GL_CBOT_1.TP GL_CBOT_2.TP U$10.25-GL_C(GL_C)
GL_CBOT_2: GL_CBOT_3.TP GL_CBOT_4.TP U$3.25-GL_C(GL_C)
GL_CBOT_3: GL_CBOT_5.TP GL_CBOT_6.TP U$21.25-GL_C(GL_C)
GL_CTOP_1: GL_CTOP_5.TP GL_CTOP_6.TP U$28.G
GL_CTOP_4: GL_CTOP_3.TP GL_CTOP_4.TP U$9.G
GND: 0005.1 0007.1 0009.1 0017.1 0019.1 0021.1 0023.1 0025.1 0027.1 C1.2 C2.1 C3.1 C4.2 C5.2 C9.2 C10.2 C11.2 C12.2 C13.2 C17.2 C18.2 C19.2 C20.2 C21.2 C26.2 C27.2 C28.2 C29.2 C30.2 C34.2 C36.2 C38.2 C39.2 C40.2 C45.2 C46.2 C47.2 C48.2 C49.2 C50.2 C51.2 C52.2 C53.2 C54.2 C55.- C57.- C58.2 C59.- C61.- C62.- C63.2 C64.- C65.- C66.- C67.- C68.- C69.- C70.- C118.2 GND.1(P) IC4.4(GND1) IC4.5(GND2) IC4.7(2A) IC4.10(3A) IC4.12(GND4) IC4.13(GND3) JP4.1 JP4.2 JP4.3 JP8.1 JP8.2 JP8.3 R17.1 R21.1 R24.1 R79.1 R80.2 R81.1 U1.12(AN_POWER:VSSA) U1.18(POWER:VSS_4) U1.31(POWER:VSS_1) U1.47(POWER:VSS_2) U1.63(POWER:VSS_3) U$2.T1 U$2.T2 U$3.14-GND1(GND1) U$3.45-GND2(GND2) U$3.POWERPAD U$10.14-GND1(GND1) U$10.45-GND2(GND2) U$10.POWERPAD U$17.ADDR U$17.GND U$20.2(GND) U$21.14-GND1(GND1) U$21.45-GND2(GND2) U$21.POWERPAD U$27.T3 U$27.T4 U$29.GND U$31.2(GND) U$32.GND U$33.2(GND) U$35.2(GND2) U$35.4(GND1) ZASILANIE.2
GND_TOP: 0001.1 0002.1 0003.1 0010.1 0011.1 0012.1 0013.1 0014.1 0015.1 JP2.1 JP2.2 JP2.3 SP_ATOP_1.TP SP_ATOP_2.TP SP_ATOP_3.TP SP_ATOP_4.TP SP_ATOP_5.TP SP_ATOP_6.TP SP_BTOP_1.TP SP_BTOP_2.TP SP_BTOP_3.TP SP_BTOP_4.TP SP_BTOP_5.TP SP_BTOP_6.TP SP_CTOP_1.TP SP_CTOP_2.TP SP_CTOP_3.TP SP_CTOP_4.TP SP_CTOP_5.TP SP_CTOP_6.TP U$18.GND U$19.GND U$30.GND ; supply symbol labelled GND
INH_A_2>: INH_A_2>.TP U$10.2-INHA(INH_A)
INH_A_2>1: INH_A_2>1.TP U$3.2-INHA(INH_A)
INH_A_2>2: INH_A_2>2.TP U$21.2-INHA(INH_A)
INH_B_2>: INH_B_2>.TP U$10.4-INHB(INH_B)
INH_B_2>1: INH_B_2>1.TP U$3.4-INHB(INH_B)
INH_B_2>2: INH_B_2>2.TP U$21.4-INHB(INH_B)
INH_C_2>: INH_C_2>.TP U$10.6-INHC(INH_C)
INH_C_2>1: INH_C_2>1.TP U$3.6-INHC(INH_C)
INH_C_2>2: INH_C_2>2.TP U$21.6-INHC(INH_C)
N$1: C10.1 U$3.46-DVDD(DVDD)
N$2: C9.1 U$3.15-AVDD(AVDD)
N$3: LED8.C R21.2
N$4: C11.1 U$3.37-VCP_LSD(VCP_LSD)
N$5: C7.2 U$3.42-CP1L(CP1L)
N$6: C7.1 U$3.43-CP1H(CP1H)
N$7: C8.2 U$3.40-CP2L(CP2L)
N$8: C8.1 U$3.39-CP2H(CP2H)
N$9: R5.1 U$3.44-VDRAIN(VDRAIN)
N$10: C36.1 U$21.46-DVDD(DVDD)
N$11: C22.2 U$3.38-VCPH(VCPH)
N$12: C34.1 U$21.15-AVDD(AVDD)
N$13: C38.1 U$21.37-VCP_LSD(VCP_LSD)
N$14: C31.2 U$21.42-CP1L(CP1L)
N$15: LED2.C R100.2
N$16: C31.1 U$21.43-CP1H(CP1H)
N$17: LED3.C R101.2
N$18: LED4.C R9.2
N$19: LED5.C R10.2
N$20: C32.2 U$21.40-CP2L(CP2L)
N$21: C32.1 U$21.39-CP2H(CP2H)
N$22: R13.1 U$21.44-VDRAIN(VDRAIN)
N$23: C14.2 U$21.38-VCPH(VCPH)
N$24: LED6.C R14.2
N$25: LED7.C R15.2
N$26: TMP_2<2.TP TMP_2<3.TP U$32.AIN_3 U$33.3(IO2)
N$27: TMP_2<4.TP TMP_2<.TP U$17.AIN_3 U$20.3(IO2)
N$28: 0008.1 0009.2 C27.1 U$17.AIN_1 U$20.4(IO3)
N$29: R23.1 U1.2(PORTC_H:PC13)
N$30: TMP_2<1.TP TMP_2<5.TP U$29.AIN_3 U$31.3(IO2)
N$31: LED8.A U1.61(PORTB_H:PB8)
N$32: SWCLK.1(P) U1.49(PORTA_H:PA14)
N$33: SWDIO.1(P) U1.46(PORTA_H:PA13)
N$34: LED9.A U1.62(PORTB_H:PB9)
N$35: SWITCH.2 ZASILANIE.1
N$36: BOOT_EMPTY.2 R18.2
N$37: BOOT_EMPTY.1 U1.60(RESET:BOOT0)
N$38: IC4.2(1A) R80.1 T1.E
N$39: IC4.15(4A) R81.2 T2.E
N$40: IC4.14(4Y) MOTOR_B.1
N$41: IC4.11(3Y) MOTOR_B.2
N$42: IC4.3(1Y) MOTOR_A.1
N$43: IC4.6(2Y) MOTOR_A.2
N$44: LED.2 R79.2
N$45: C3.2 R1.2 U1.13(AN_POWER:VDDA)
N$58: C18.1 U$10.46-DVDD(DVDD)
N$59: C17.1 U$10.15-AVDD(AVDD)
N$60: C19.1 U$10.37-VCP_LSD(VCP_LSD)
N$61: C15.2 U$10.42-CP1L(CP1L)
N$62: C15.1 U$10.43-CP1H(CP1H)
N$63: C16.2 U$10.40-CP2L(CP2L)
N$64: C16.1 U$10.39-CP2H(CP2H)
N$77: GL_CTOP_1.TP GL_CTOP_2.TP U$16.G
N$78: IC1.1(ADJ) R17.2 R19.1
N$79: C63.1 R22.1 R23.2 U$2.T3 U$2.T4
N$81: LED9.C R24.2
N$82: R8.1 U$10.44-VDRAIN(VDRAIN)
N$83: C41.2 U$10.38-VCPH(VCPH)
NFAULT: NFAULT_3.TP R7.1 R10.1 U$10.8-NFAULT(NFAULT)
NFAULT1: NFAULT_2.TP R4.1 R101.1 U$3.8-NFAULT(NFAULT)
NFAULT2: NFAULT_1.TP R12.1 R15.1 U$21.8-NFAULT(NFAULT)
NFAULT_1: NFAULT_1_P.TP U1.50(PORTA_H:PA15)
NFAULT_2: NFAULT_2_P.TP U1.24(PORTC_L:PC4)
NFAULT_3: NFAULT_3_P.TP U1.14(PORTA_L:PA0)
NRST: C4.1 JP12.3 NRST.1(P) R16.2 U1.7(RESET:NRST) U$27.T1 U$27.T2
NSCS_1: NSCS_1_P.TP U1.33(PORTB_H:PB12)
NSCS_2: NSCS_2_P.TP U1.23(PORTA_L:PA7)
NSCS_2>: NSCS_2>.TP U$10.9-NSCS(NSCS)
NSCS_2>1: NSCS_2>1.TP U$3.9-NSCS(NSCS)
NSCS_2>2: NSCS_2>2.TP U$21.9-NSCS(NSCS)
NSCS_3: NSCS_3_P.TP U1.11(PORTC_L:PC3)
OSC1: C1.1 U1.5(PORTD/OSC:PD0/OSC<=) U$35.1
OSC2: C2.2 U1.6(PORTD/OSC:PD1/OSC=>) U$35.3
PWM_1A: PWM_1A_P.TP U1.43(PORTA_H:PA10)
PWM_1B: PWM_1B_P.TP U1.42(PORTA_H:PA9)
PWM_1C: PWM_1C_P.TP U1.41(PORTA_H:PA8)
PWM_2A: PWM_2A_P.TP U1.37(PORTC_L:PC6)
PWM_2B: PWM_2B_P.TP U1.38(PORTC_L:PC7)
PWM_2C: PWM_2C_P.TP U1.39(PORTC_H:PC8)
PWM_3A: PWM_3A_P.TP U1.17(PORTA_L:PA3)
PWM_3B: PWM_3B_P.TP U1.16(PORTA_L:PA2)
PWM_3C: PWM_3C_P.TP U1.15(PORTA_L:PA1)
PWRGD: R6.1 R9.1 U$10.13-PWRGD(PWRGD)
PWRGD1: R3.1 R100.1 U$3.13-PWRGD(PWRGD)
PWRGD2: R11.1 R14.1 U$21.13-PWRGD(PWRGD)
SCL: SCL_P.TP U1.29(PORTB_H:PB10)
SCL_2>: R20.2 SCL_2>.TP U$17.SCL U$29.SCL U$32.ADDR U$32.SCL
SCL_DRIVER: JP12.1 R78.2 U1.58(PORTB_L:PB6)
SCLK: SCLK_P.TP U1.34(PORTB_H:PB13)
SCLK_2>: SCLK_2>.TP U$3.12-SCLK(SCLK) U$10.12-SCLK(SCLK) U$21.12-SCLK(SCLK)
SDA: SDA_P.TP U1.30(PORTB_H:PB11)
SDA_2>: R25.2 SDA_2>.TP U$17.SDA U$29.SDA U$32.SDA
SDA_DRIVER: JP12.2 R77.2 U1.59(PORTB_L:PB7)
SDI: SDI_P.TP U1.36(PORTB_H:PB15)
SDI_2>: SDI_2>.TP U$3.10-SDI(SDI) U$10.10-SDI(SDI) U$21.10-SDI(SDI)
SDO: SDO_P.TP U1.35(PORTB_H:PB14)
SDO_2>: SDO_2>.TP U$3.11-SDO(SDO) U$10.11-SDO(SDO) U$21.11-SDO(SDO)
SH_ABOT_1: 0024.2 SH_ABOT_1.TP SH_ABOT_2.TP U$10.35-SH_A(SH_A)
SH_ABOT_2: 0006.2 SH_ABOT_3.TP SH_ABOT_4.TP U$3.35-SH_A(SH_A)
SH_ABOT_3: 0018.2 SH_ABOT_5.TP SH_ABOT_6.TP U$21.35-SH_A(SH_A)
SH_ATOP_1: PAD1.1(P) SH_ATOP_1.TP SH_ATOP_2.TP U$13.S1(S) U$13.S2(S) U$13.S3(S) U$14.D1(D) U$14.D2(D) U$14.D3(D) U$14.D4(D) U$14.D5(D)
SH_ATOP_2: PAD7.1(P) SH_ATOP_5.TP SH_ATOP_6.TP U$24.S1(S) U$24.S2(S) U$24.S3(S) U$25.D1(D) U$25.D2(D) U$25.D3(D) U$25.D4(D) U$25.D5(D)
SH_ATOP_4: PAD2.1(P) SH_ATOP_3.TP SH_ATOP_4.TP U$6.S1(S) U$6.S2(S) U$6.S3(S) U$7.D1(D) U$7.D2(D) U$7.D3(D) U$7.D4(D) U$7.D5(D)
SH_BBOT_1: 0026.2 SH_BBOT_1.TP SH_BBOT_2.TP U$10.30-SH_B(SH_B)
SH_BBOT_2: 0008.2 SH_BBOT_3.TP SH_BBOT_4.TP U$3.30-SH_B(SH_B)
SH_BBOT_3: 0020.2 SH_BBOT_5.TP SH_BBOT_6.TP U$21.30-SH_B(SH_B)
SH_BTOP_1: PAD3.1(P) SH_BTOP_1.TP SH_BTOP_2.TP U$11.S1(S) U$11.S2(S) U$11.S3(S) U$12.D1(D) U$12.D2(D) U$12.D3(D) U$12.D4(D) U$12.D5(D)
SH_BTOP_2: PAD8.1(P) SH_BTOP_5.TP SH_BTOP_6.TP U$22.S1(S) U$22.S2(S) U$22.S3(S) U$23.D1(D) U$23.D2(D) U$23.D3(D) U$23.D4(D) U$23.D5(D)
SH_BTOP_4: PAD4.1(P) SH_BTOP_3.TP SH_BTOP_4.TP U$4.S1(S) U$4.S2(S) U$4.S3(S) U$5.D1(D) U$5.D2(D) U$5.D3(D) U$5.D4(D) U$5.D5(D)
SH_C_2>: PAD5.1(P) SH_CTOP_1.TP SH_CTOP_2.TP U$15.S1(S) U$15.S2(S) U$15.S3(S) U$16.D1(D) U$16.D2(D) U$16.D3(D) U$16.D4(D) U$16.D5(D)
SH_CBOT_1: 0022.2 SH_CBOT_1.TP SH_CBOT_2.TP U$10.27-SH_C(SH_C)
SH_CBOT_2: 0004.2 SH_CBOT_3.TP SH_CBOT_4.TP U$3.27-SH_C(SH_C)
SH_CBOT_3: 0016.2 SH_CBOT_5.TP SH_CBOT_6.TP U$21.27-SH_C(SH_C)
SH_CTOP_1: PAD9.1(P) SH_CTOP_5.TP SH_CTOP_6.TP U$26.S1(S) U$26.S2(S) U$26.S3(S) U$28.D1(D) U$28.D2(D) U$28.D3(D) U$28.D4(D) U$28.D5(D)
SH_CTOP_4: PAD6.1(P) SH_CTOP_3.TP SH_CTOP_4.TP U$8.S1(S) U$8.S2(S) U$8.S3(S) U$9.D1(D) U$9.D2(D) U$9.D3(D) U$9.D4(D) U$9.D5(D)
SL_ABOT_1: C33.1 SL_ABOT_1.TP SL_ABOT_2.TP U$10.23-SN1(SN1) U$10.34-SL_A(SL_A)
SL_ABOT_2: C23.1 SL_ABOT_3.TP SL_ABOT_4.TP U$3.23-SN1(SN1) U$3.34-SL_A(SL_A)
SL_ABOT_3: C42.1 SL_ABOT_5.TP SL_ABOT_6.TP U$21.23-SN1(SN1) U$21.34-SL_A(SL_A)
SL_ATOP_1: 0011.2 SL_ATOP_1.TP SL_ATOP_2.TP U$14.S1(S) U$14.S2(S) U$14.S3(S)
SL_ATOP_2: 0014.2 SL_ATOP_5.TP SL_ATOP_6.TP U$25.S1(S) U$25.S2(S) U$25.S3(S)
SL_ATOP_4: 0002.2 SL_ATOP_3.TP SL_ATOP_4.TP U$7.S1(S) U$7.S2(S) U$7.S3(S)
SL_BOT_1: C35.1 SL_BOT_1.TP SL_BOT_2.TP U$10.21-SN2(SN2) U$10.31-SL_B(SL_B)
SL_BOT_2: C24.1 SL_BOT_3.TP SL_BOT_4.TP U$3.21-SN2(SN2) U$3.31-SL_B(SL_B)
SL_BOT_3: C43.1 SL_BOT_5.TP SL_BOT_6.TP U$21.21-SN2(SN2) U$21.31-SL_B(SL_B)
SL_BTOP_1: 0010.2 SL_BTOP_1.TP SL_BTOP_2.TP U$12.S1(S) U$12.S2(S) U$12.S3(S)
SL_BTOP_2: 0013.2 SL_BTOP_5.TP SL_BTOP_6.TP U$23.S1(S) U$23.S2(S) U$23.S3(S)
SL_BTOP_4: 0001.2 SL_BTOP_3.TP SL_BTOP_4.TP U$5.S1(S) U$5.S2(S) U$5.S3(S)
SL_C_2<2: C44.1 SL_CBOT_5.TP SL_CBOT_6.TP U$21.19-SN3(SN3) U$21.26-SL_C(SL_C)
SL_C_2>: 0012.2 SL_CTOP_1.TP SL_CTOP_2.TP U$16.S1(S) U$16.S2(S) U$16.S3(S)
SL_CBOT_1: C37.1 SL_CBOT_1.TP SL_CBOT_2.TP U$10.19-SN3(SN3) U$10.26-SL_C(SL_C)
SL_CBOT_2: C25.1 SL_CBOT_3.TP SL_CBOT_4.TP U$3.19-SN3(SN3) U$3.26-SL_C(SL_C)
SL_CTOP_1: 0015.2 SL_CTOP_5.TP SL_CTOP_6.TP U$28.S1(S) U$28.S2(S) U$28.S3(S)
SL_CTOP_4: 0003.2 SL_CTOP_3.TP SL_CTOP_4.TP U$9.S1(S) U$9.S2(S) U$9.S3(S)
SO1_2>: SO1_2>.TP U$10.16-SO1(SO1)
SO1_2>1: SO1_2>1.TP U$3.16-SO1(SO1)
SO1_2>2: SO1_2>2.TP U$21.16-SO1(SO1)
SO2_2>: SO2_2>.TP U$10.17-SO2(SO2)
SO2_2>1: SO2_2>1.TP U$3.17-SO2(SO2)
SO2_2>2: SO2_2>2.TP U$21.17-SO2(SO2)
SO3_2>: SO3_2>.TP U$10.18-SO3(SO3)
SO3_2>1: SO3_2>1.TP U$3.18-SO3(SO3)
SO3_2>2: SO3_2>2.TP U$21.18-SO3(SO3)
SP_ABOT_1: C33.2 SP_ABOT_1.TP SP_ABOT_2.TP U$10.24-SP1(SP1)
SP_ABOT_2: C23.2 SP_ABOT_3.TP SP_ABOT_4.TP U$3.24-SP1(SP1)
SP_ABOT_3: C42.2 SP_ABOT_5.TP SP_ABOT_6.TP U$21.24-SP1(SP1)
SP_BBOT_1: C35.2 SP_BBOT_1.TP SP_BBOT_2.TP U$10.22-SP2(SP2)
SP_BBOT_2: C24.2 SP_BBOT_3.TP SP_BBOT_4.TP U$3.22-SP2(SP2)
SP_BBOT_3: C43.2 SP_BBOT_5.TP SP_BBOT_6.TP U$21.22-SP2(SP2)
SP_CBOT_1: C37.2 SP_CBOT_1.TP SP_CBOT_2.TP U$10.20-SP3(SP3)
SP_CBOT_2: C25.2 SP_CBOT_3.TP SP_CBOT_4.TP U$3.20-SP3(SP3)
SP_CBOT_3: C44.2 SP_CBOT_5.TP SP_CBOT_6.TP U$21.20-SP3(SP3)
TMP_1: TMP_1.TP TMP_2.TP U$18.VOUT
TMP_2>: TMP_2>3.TP TMP_2>.TP U$19.VOUT
TMP_2>1: TMP_2>1.TP TMP_2>2.TP U$30.VOUT
VCC: IC4.1(1-2EN) IC4.8(VCC2) IC4.9(3-4EN) IC4.16(VCC1) LED.1 SWITCH.1 T1.C T2.C
VMOTOR: C13.1 C14.1 C21.1 C22.1 C40.1 C41.1 JP3.1 JP3.2 JP3.3 R5.2 R8.2 R13.2 U$3.41-PVDD(PVDD) U$10.41-PVDD(PVDD) U$21.41-PVDD(PVDD) ; supply symbol labelled VMotor
VMOTOR_BOTTOM: C59.+ C61.+ C62.+ C64.+ C65.+ C66.+ C67.+ C68.+ C69.+ C70.+ C118.1 IC1.3(IN) JP9.1 JP9.2 JP9.3
VMOTOR_TOP: JP1.1 JP1.2 JP1.3 U$4.D1(D) U$4.D2(D) U$4.D3(D) U$4.D4(D) U$4.D5(D) U$6.D1(D) U$6.D2(D) U$6.D3(D) U$6.D4(D) U$6.D5(D) U$8.D1(D) U$8.D2(D) U$8.D3(D) U$8.D4(D) U$8.D5(D) U$11.D1(D) U$11.D2(D) U$11.D3(D) U$11.D4(D) U$11.D5(D) U$13.D1(D) U$13.D2(D) U$13.D3(D) U$13.D4(D) U$13.D5(D) U$15.D1(D) U$15.D2(D) U$15.D3(D) U$15.D4(D) U$15.D5(D) U$22.D1(D) U$22.D2(D) U$22.D3(D) U$22.D4(D) U$22.D5(D) U$24.D1(D) U$24.D2(D) U$24.D3(D) U$24.D4(D) U$24.D5(D) U$26.D1(D) U$26.D2(D) U$26.D3(D) U$26.D4(D) U$26.D5(D) ; supply symbol labelled VMotor
WAKE_1: U1.45(PORTA_H:PA12) WAKE_1_P.TP
WAKE_2: U1.40(PORTC_H:PC9) WAKE_2_P.TP
WAKE_3: U1.3(PORTC_H:PC14) WAKE_3_P.TP
WAKE_MID_1: U$21.47-WAKE(WAKE) WAKE_1.TP
WAKE_MID_2: U$3.47-WAKE(WAKE) WAKE_MID_2.TP
WAKE_MID_3: U$10.47-WAKE(WAKE) WAKE_MID_3.TP
Unconnected: U1.51(PORTC_H:PC10) U1.52(PORTC_H:PC11) U1.53(PORTC_H:PC12) U1.54(PORTD/OSC:PD2) U1.55(PORTB_L:PB3) U1.56(PORTB_L:PB4) U1.57(PORTB_L:PB5) U$3.3-INLA(INL_A) U$3.5-INLB(INL_B) U$3.7-INLC(INL_C) U$10.3-INLA(INL_A) U$10.5-INLB(INL_B) U$10.7-INLC(INL_C) U$17.NC U$21.3-INLA(INL_A) U$21.5-INLB(INL_B) U$21.7-INLC(INL_C) U$29.NC U$32.NC

## Notes on the sheet
- UBER Motor Controller | UBER Motor Controller
- Bottom Board 1/3 | Middle Board 2/3 | Top Board 3/3
- drut do zaislnia
- by zmniejszyc rezystancje sciezek
- STM32F103RB | Pads
- NFAULT_3 | << | <<
- PWM_3C | Controll 1
- PWM_3B
- PWM_3A
- A6 | PWM 1
- A5
- A4
- NSCS_2 | << | <<
- Controll 1
- PWM_1C | Spi
- PWM_1B
- PWM_1A
- ENGATE_1
- WAKE_1 | SWD
- Analog current sense 1
- NFAULT_1
- NRST
- A2
- A3
- ENGATE_2 | Controll 2
- I2C
- I2C sterownania
- SCL
- SDA | PWM 2
- NRST
- LED
- LED | Controll 2
- SCL
- SDA | Spi chips select 2
- NSCS_1
- SCLK | Analog current sense 2
- SDO
- SDI
- A9
- A8 | Controll 3
- A7
- NSCS_3
- NFAULT_2 | << | << | PWM 3
- A1
- PWM_2A
- PWM_2B
- Controll 3
- PWM_2C | Spi chip select 3
- WAKE_2
- 3V3
- Analog current sense 3
- BUTTON
- WAKE_3
- ENGATE_3
- Osc 8MHz
- Power 3v3 & VDRAIN | U1 Power
- 2200uF 
  Dla bienych mosfetow
- VMOTOR_Bottom | Reset

## Power pins joined to a net without a drawn wire
VBAT: U1.1(AN_POWER:VBAT)

## Library data of the parts
0001-0009 0010-0027 BOOT_EMPTY R1 R3-R25 R77 R78 R100 R101 = resistor:R-EU_: RESISTOR, European symbol
3.3V 3.3V1-3.3V4 3V3_P A1_P A2_P A3_P A4_P A5_P A6_P A7_P A8_P A9_P EN_GATE_MID_1-EN_GATE_MID_3 ENGATE_1_P ENGATE_2_P ENGATE_3_P GH_ABOT_1-GH_ABOT_6 GH_ATOP_1-GH_ATOP_6 GH_BBOT_1-GH_BBOT_6 GH_BTOP_1-GH_BTOP_6 GH_CBOT_1-GH_CBOT_6 GH_CTOP_1-GH_CTOP_6 GL_ABOT_1-GL_ABOT_6 GL_ATOP_1-GL_ATOP_6 GL_BBOT_1-GL_BBOT_6 GL_BTOP_1-GL_BTOP_6 GL_CBOT_1-GL_CBOT_6 GL_CTOP_1-GL_CTOP_6 INH_A_2> INH_A_2>1 INH_A_2>2 INH_B_2> INH_B_2>1 INH_B_2>2 INH_C_2> INH_C_2>1 INH_C_2>2 NFAULT_1 NFAULT_1_P NFAULT_2 NFAULT_2_P NFAULT_3 NFAULT_3_P NSCS_1_P NSCS_2> NSCS_2>1 NSCS_2>2 NSCS_2_P NSCS_3_P PWM_1A_P PWM_1B_P PWM_1C_P PWM_2A_P PWM_2B_P PWM_2C_P PWM_3A_P PWM_3B_P PWM_3C_P SCL_2> SCL_P SCLK_2> SCLK_P SDA_2> SDA_P SDI_2> SDI_P SDO_2> SDO_P SH_ABOT_1-SH_ABOT_6 SH_ATOP_1-SH_ATOP_6 SH_BBOT_1-SH_BBOT_6 SH_BTOP_1-SH_BTOP_6 SH_CBOT_1-SH_CBOT_6 SH_CTOP_1-SH_CTOP_6 SL_ABOT_1-SL_ABOT_6 SL_ATOP_1-SL_ATOP_6 SL_BOT_1-SL_BOT_6 SL_BTOP_1-SL_BTOP_6 SL_CBOT_1-SL_CBOT_6 SL_CTOP_1-SL_CTOP_6 SO1_2> SO1_2>1 SO1_2>2 SO2_2> SO2_2>1 SO2_2>2 SO3_2> SO3_2>1 SO3_2>2 SP_ABOT_1-SP_ABOT_6 SP_ATOP_1-SP_ATOP_6 SP_BBOT_1-SP_BBOT_6 SP_BTOP_1-SP_BTOP_6 SP_CBOT_1-SP_CBOT_6 SP_CTOP_1-SP_CTOP_6 TMP_1 TMP_2 TMP_2< TMP_2<1-TMP_2<5 TMP_2> TMP_2>1-TMP_2>3 WAKE_1 WAKE_1_P WAKE_2_P WAKE_3_P WAKE_MID_2 WAKE_MID_3 = testpad:TP: Test pad
C1-C5 C7-C54 C58 C63 C118 = rcl:C-EU: CAPACITOR, European symbol; SPICEPREFIX: C
C55 C57 C59 C61 C62 C64-C70 = rcl:CPOL-EU: POLARIZED CAPACITOR, European symbol; SPICEPREFIX: C
GND NRST SWCLK SWDIO VDDTARGET = wirepad:WIREPAD: Wire PAD connect wire on PCB
H1 H3 H4 = holes:MOUNT-HOLE: MOUNTING HOLE with drill center marker
IC1 = v-reg:LM317?*: 500 mA Adjustable Output Positive Voltage Regulator Source: http://www.onsemi.co.jp .. LM317M-D.PDF
IC4 = st-microelectronics:L293D: PUSH-PULL 4 CHANNEL DRIVER; MPN: L293D; OC_FARNELL: 9589619; OC_NEWARK: 56P8249
JP1-JP4 JP8 JP9 JP12 = adafruit:PINHD-1X3: PIN HEADER
LED MOTOR_A MOTOR_B SWITCH ZASILANIE = pinhead:PINHD-1X2: PIN HEADER
LED2-LED9 = led:LED: LED OSRAM: - CHIPLED LG R971, LG N971, LY N971, LG Q971, LY Q971, LO R971, LY R971 LH N974, LH R974 LS Q976, LO Q976, LY Q976 LO Q996 - Hyper CHIPLED LW Q18S LB Q993, LB Q99A, LB R99A - SideLED LS A670, LO A670, LY A670, LG A670, LP A670 LB A673, LV A673, LT A673, LW A673 LH A674 LY A675 LS A676, LA A676, LO A676, LY A676, LW A676 LS A679, LY A679, LG A679 - Hyper Micro SIDELED® LS Y876, LA Y876, LO Y876, LY Y876 LT Y87S - SmartLED LW L88C, LW L88S LB L89C, LB L89S, LG L890 LS L89K, LO L89K, LY L89K LS L896, LA L896, LO L896, LY L896 - TOPLED LS T670, LO T670, LY T670, LG T670, LP T670 LSG T670, LSP T670, LSY T670, LOP T670, LYG T670 LG T671, LOG T671, LSG T671 LB T673, LV T673, LT T673, LW T673 LH T674 LS T676, LA T676, LO T676, LY T676, LB T676, LH T676, LSB T676, LW T676 LB T67C, LV T67C, LT T67C, LS T67K, LO T67K, LY T67K, LW E67C LS E67B, LA E67B, LO E67B, LY E67B, LB E67C, LV E67C, LT E67C LW T67C LS T679, LY T679, LG T679 LS T770, LO T770, LY T770, LG T770, LP T770 LB T773, LV T773, LT T773, LW T773 LH T774 LS E675, LA E675, LY E675, LS T675 LS T776, LA T776, LO T776, LY T776, LB T776 LHGB T686 LT T68C, LB T68C - Hyper Mini TOPLED® LB M676 - Mini TOPLED Santana® LG M470 LS M47K, LO M47K, LY M47K Source: http://www.osram.convergy.de LUXEON: - LUMILED® LXK2-PW12-R00, LXK2-PW12-S00, LXK2-PW14-U00, LXK2-PW14-V00 LXK2-PM12-R00, LXK2-PM12-S00, LXK2-PM14-U00 LXK2-PE12-Q00, LXK2-PE12-R00, LXK2-PE12-S00, LXK2-PE14-T00, LXK2-PE14-U00 LXK2-PB12-K00, LXK2-PB12-L00, LXK2-PB12-M00, LXK2-PB14-N00, LXK2-PB14-P00, LXK2-PB14-Q00 LXK2-PR12-L00, LXK2-PR12-M00, LXK2-PR14-Q00, LXK2-PR14-R00 LXK2-PD12-Q00, LXK2-PD12-R00, LXK2-PD12-S00 LXK2-PH12-R00, LXK2-PH12-S00 LXK2-PL12-P00, LXK2-PL12-Q00, LXK2-PL12-R00 Source: www.luxeon.com KINGBRIGHT: KA-3528ASYC Source: www.kingbright.com
PAD1-PAD9 = wirepad:SMD5: SMD PAD
R79-R81 = rcl:R-EU_: RESISTOR, European symbol; SPICEPREFIX: R
T1 T2 = opto-trans-siemens:BPX81: PHOTO TRANSISTOR; OC_FARNELL: unknown; OC_NEWARK: unknown
U1 = stm32:STM32F10XRXT6: STM32F101/103 64pin LQFP
U$2 U$27 = SuperDuperGuziczek:SUPER_DUPER_GUZICZEK
U$3 U$10 U$21 = drv8305lbr:DRV8305
U$4-U$9 U$11-U$16 U$22-U$26 U$28 = CSD_Mosfet:CSD17573Q5B
U$17 U$29 U$32 = TLA2024:TLA2024
U$18 U$19 U$30 = TMP235:TMP235
U$20 U$31 U$33 = tpd4e001:TPD4E001
U$35 = cfpx-104-8mhz:8MHZ